# Altium schematic sheet 04 - SRAM_FLASH.SchDoc
size A4; SheetNumber: 4; SheetTotal: 7
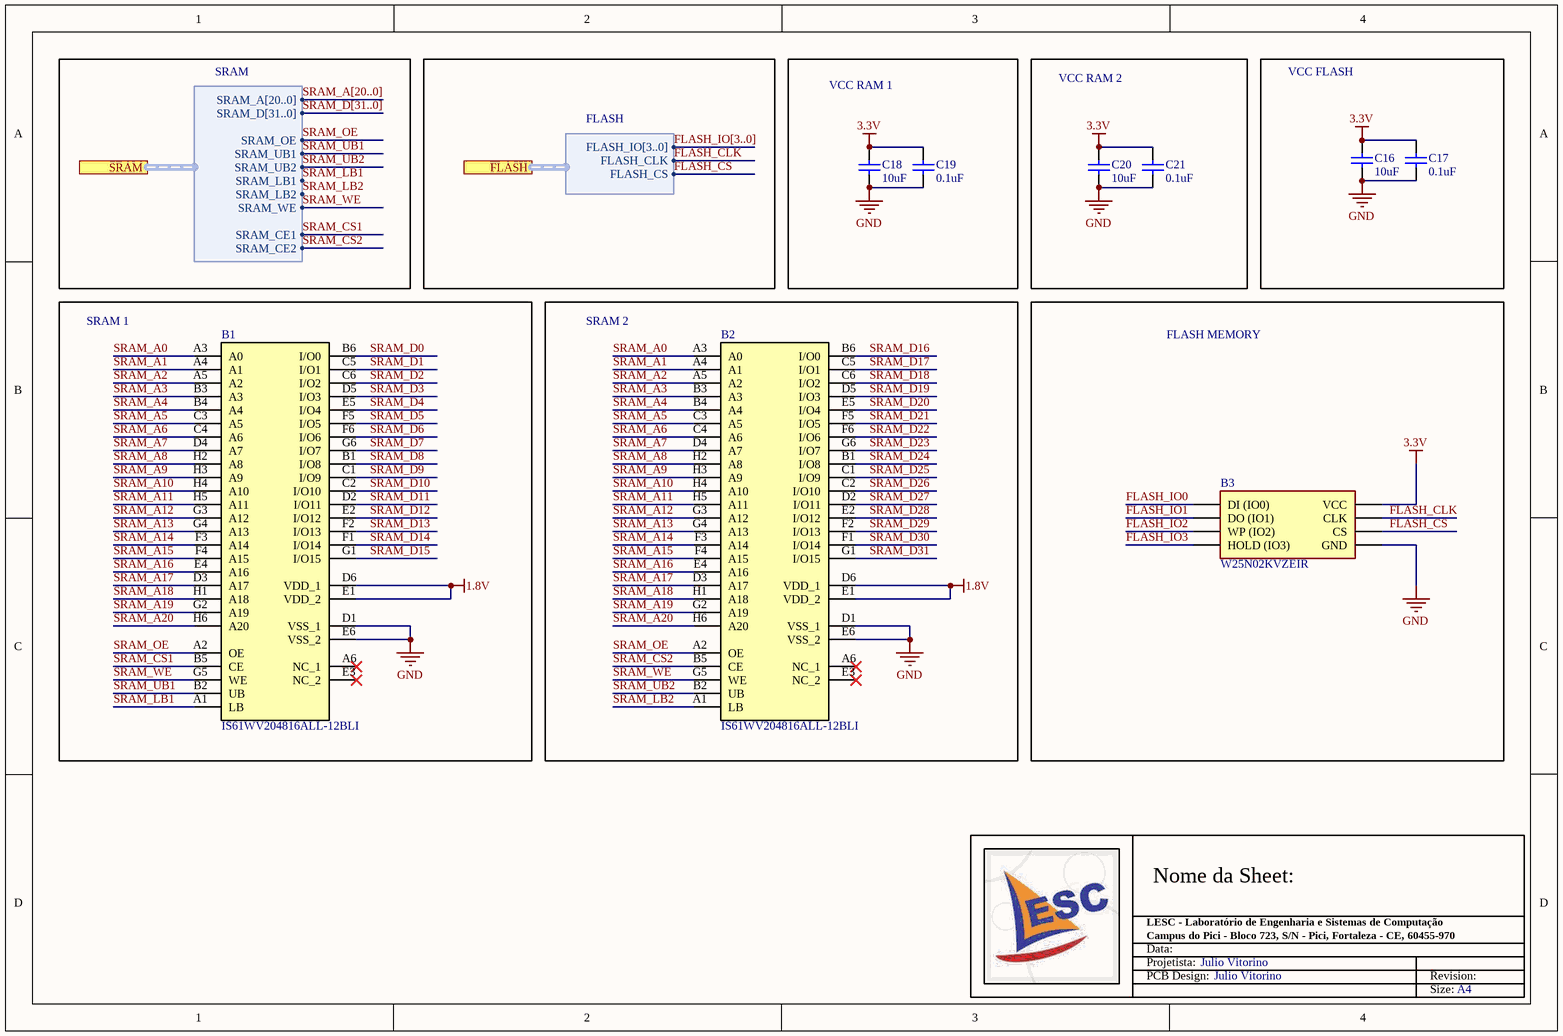
[diagram p0: 04 - SRAM_FLASH.SchDoc]

## Parts
B1  IS61WV204816ALL-12BLI  [BGA48C75P6X8_600X800X120]
B2  IS61WV204816ALL-12BLI  [BGA48C75P6X8_600X800X120]
B3  W25N02KVZEIR  [SON127P800X600X80-9N]
C16  CAPACITANCE: 10uF  [0402-C-R]  (hidden comment: CAP CER 10UF 6.3V X5R 0402)
C17  CAPACITANCE: 0.1uF  [0402-C-R]  (hidden comment: GRM155R71C104KA88J)
C18  CAPACITANCE: 10uF  [0402-C-R]  (hidden comment: CAP CER 10UF 6.3V X5R 0402)
C19  CAPACITANCE: 0.1uF  [0402-C-R]  (hidden comment: GRM155R71C104KA88J)
C20  CAPACITANCE: 10uF  [0402-C-R]  (hidden comment: CAP CER 10UF 6.3V X5R 0402)
C21  CAPACITANCE: 0.1uF  [0402-C-R]  (hidden comment: GRM155R71C104KA88J)

## Blocks framed on the sheet
VCC RAM 1: C18 C19
VCC RAM 2: C20 C21
VCC FLASH: C16 C17
SRAM 1: B1
SRAM 2: B2
FLASH MEMORY: B3

## Ports
FLASH (harness FLASH), SRAM (harness SRAM)

## Harnesses
SRAM: SRAM_A[20..0], SRAM_D[31..0], SRAM_OE, SRAM_UB1, SRAM_UB2, SRAM_WE, SRAM_CE1, SRAM_CE2, SRAM_LB2, SRAM_LB1
FLASH: FLASH_IO[3..0], FLASH_CLK, FLASH_CS

## Nets
1.8V: B1.D6(VDD_1) B1.E1(VDD_2) B2.D6(VDD_1) B2.E1(VDD_2)
3.3V: B3.8(VCC) C16.2 C17.2 C18.2 C19.2 C20.2 C21.2
GND: B1.D1(VSS_1) B1.E6(VSS_2) B2.D1(VSS_1) B2.E6(VSS_2) B3.4,_9(GND) C16.1 C17.1 C18.1 C19.1 C20.1 C21.1
FLASH_CLK: B3.6(CLK) ; port FLASH.FLASH_CLK
FLASH_CS: B3.1(CS) ; port FLASH.FLASH_CS
FLASH_IO0: B3.5(DI_(IO0))
FLASH_IO1: B3.2(DO_(IO1))
FLASH_IO2: B3.3(WP_(IO2))
FLASH_IO3: B3.7(HOLD_(IO3))
SRAM_A0: B1.A3(A0) B2.A3(A0)
SRAM_A1: B1.A4(A1) B2.A4(A1)
SRAM_A2: B1.A5(A2) B2.A5(A2)
SRAM_A3: B1.B3(A3) B2.B3(A3)
SRAM_A4: B1.B4(A4) B2.B4(A4)
SRAM_A5: B1.C3(A5) B2.C3(A5)
SRAM_A6: B1.C4(A6) B2.C4(A6)
SRAM_A7: B1.D4(A7) B2.D4(A7)
SRAM_A8: B1.H2(A8) B2.H2(A8)
SRAM_A9: B1.H3(A9) B2.H3(A9)
SRAM_A10: B1.H4(A10) B2.H4(A10)
SRAM_A11: B1.H5(A11) B2.H5(A11)
SRAM_A12: B1.G3(A12) B2.G3(A12)
SRAM_A13: B1.G4(A13) B2.G4(A13)
SRAM_A14: B1.F3(A14) B2.F3(A14)
SRAM_A15: B1.F4(A15) B2.F4(A15)
SRAM_A16: B1.E4(A16) B2.E4(A16)
SRAM_A17: B1.D3(A17) B2.D3(A17)
SRAM_A18: B1.H1(A18) B2.H1(A18)
SRAM_A19: B1.G2(A19) B2.G2(A19)
SRAM_A20: B1.H6(A20) B2.H6(A20)
SRAM_CS1: B1.B5(CE) ; port SRAM.SRAM_CE1
SRAM_CS2: B2.B5(CE) ; port SRAM.SRAM_CE2
SRAM_D0: B1.B6(I/O0)
SRAM_D1: B1.C5(I/O1)
SRAM_D2: B1.C6(I/O2)
SRAM_D3: B1.D5(I/O3)
SRAM_D4: B1.E5(I/O4)
SRAM_D5: B1.F5(I/O5)
SRAM_D6: B1.F6(I/O6)
SRAM_D7: B1.G6(I/O7)
SRAM_D8: B1.B1(I/O8)
SRAM_D9: B1.C1(I/O9)
SRAM_D10: B1.C2(I/O10)
SRAM_D11: B1.D2(I/O11)
SRAM_D12: B1.E2(I/O12)
SRAM_D13: B1.F2(I/O13)
SRAM_D14: B1.F1(I/O14)
SRAM_D15: B1.G1(I/O15)
SRAM_D16: B2.B6(I/O0)
SRAM_D17: B2.C5(I/O1)
SRAM_D18: B2.C6(I/O2)
SRAM_D19: B2.D5(I/O3)
SRAM_D20: B2.E5(I/O4)
SRAM_D21: B2.F5(I/O5)
SRAM_D22: B2.F6(I/O6)
SRAM_D23: B2.G6(I/O7)
SRAM_D24: B2.B1(I/O8)
SRAM_D25: B2.C1(I/O9)
SRAM_D26: B2.C2(I/O10)
SRAM_D27: B2.D2(I/O11)
SRAM_D28: B2.E2(I/O12)
SRAM_D29: B2.F2(I/O13)
SRAM_D30: B2.F1(I/O14)
SRAM_D31: B2.G1(I/O15)
SRAM_LB1: B1.A1(LB) ; port SRAM.SRAM_LB1
SRAM_LB2: B2.A1(LB) ; port SRAM.SRAM_LB2
SRAM_OE: B1.A2(OE) B2.A2(OE) ; port SRAM.SRAM_OE
SRAM_UB1: B1.B2(UB) ; port SRAM.SRAM_UB1
SRAM_UB2: B2.B2(UB) ; port SRAM.SRAM_UB2
SRAM_WE: B1.G5(WE) B2.G5(WE) ; port SRAM.SRAM_WE

Not connected (* = marked no-connect by the designer): B1 A6(NC_1)* E3(NC_2)*; B2 A6(NC_1)* E3(NC_2)*

## Buses and harness runs
bus FLASH_IO[3..0]
bus SRAM_A[20..0]
bus SRAM_D[31..0]

## Notes on the sheet
- LESC - Laboratório de Engenharia e Sistemas de Computação
- Nome da Sheet:
- Data:
- Projetista:
- PCB Design:
- Campus do Pici - Bloco 723, S/N - Pici, Fortaleza - CE, 60455-970
- Julio Vitorino
- Revision:
- Size:
- A4

## Library data of the parts
B1 B2 = IC SRAM 32MBIT PARALLEL 48TFBGA: SRAM - Asynchronous Memory IC 32Mbit Parallel 10 ns 48-TFBGA (6x8); Manufacturer_Name: Integrated Silicon Solution Inc.; Manufacturer_Part_Number: IS61WV204816BLL-10BLI; Geometry.Height: 1.2mm; Mouser Part Number: 870-WV204816BLL10BLI; Mouser Price/Stock: https://www.mouser.co.uk/ProductDetail/ISSI/IS61WV204816BLL-10BLI?qs=cttFivMKqWygmzV9oE9bxA%3D%3D; Datasheet Link: http://www.issi.com/WW/pdf/61-64WV204816BLL.pdf; PN: IS61WV204816ALL-12BLI
B3 = IC FLASH 2GBIT SPI/QUAD 8WSON: FLASH - NAND (SLC) Memory IC 2Gbit SPI - Quad I/O 104 MHz 7 ns 8-WSON (8x6) / PN: W25N02KVZEIR; Manufacturer_Name: Winbond; Geometry.Height: 0.8mm; Mouser Part Number: 454-W25N02KVZEIR; Mouser Price/Stock: https://www.mouser.co.uk/ProductDetail/Winbond/W25N02KVZEIR?qs=YwPsRIUVAOeLKi4%2F%2FEoBOQ%3D%3D; Manufacturer_Part_Number: W25N02KVZEIR; Datasheet Link: https://www.winbond.com/resource-files/W25N02KVxxIRU_Datasheet_20210625_G.pdf; PN: W25N02KVZEIR
C16 C18 C20 = CAP CER 10UF 6.3V X5R 0402: 10 µF ±20% 6.3V Ceramic Capacitor X5R 0402 (1005 Metric) / PN: GRM155R60J106ME05D; Mfr_Name: Murata; Type: Ceramic Capacitors; PN: GRM155R60J106ME05D
C17 C19 C21 = CAP CER 0.1UF 16V X7R 0402: 0.1 µF ±10% 16V Ceramic Capacitor X7R 0402 (1005 Metric) / PN: GRM155R71C104KA88J; Mfr_Name: Murata; PN: GRM155R71C104KA88J